# Altium schematic sheet MIPI_CSI-2.SchDoc
size A2
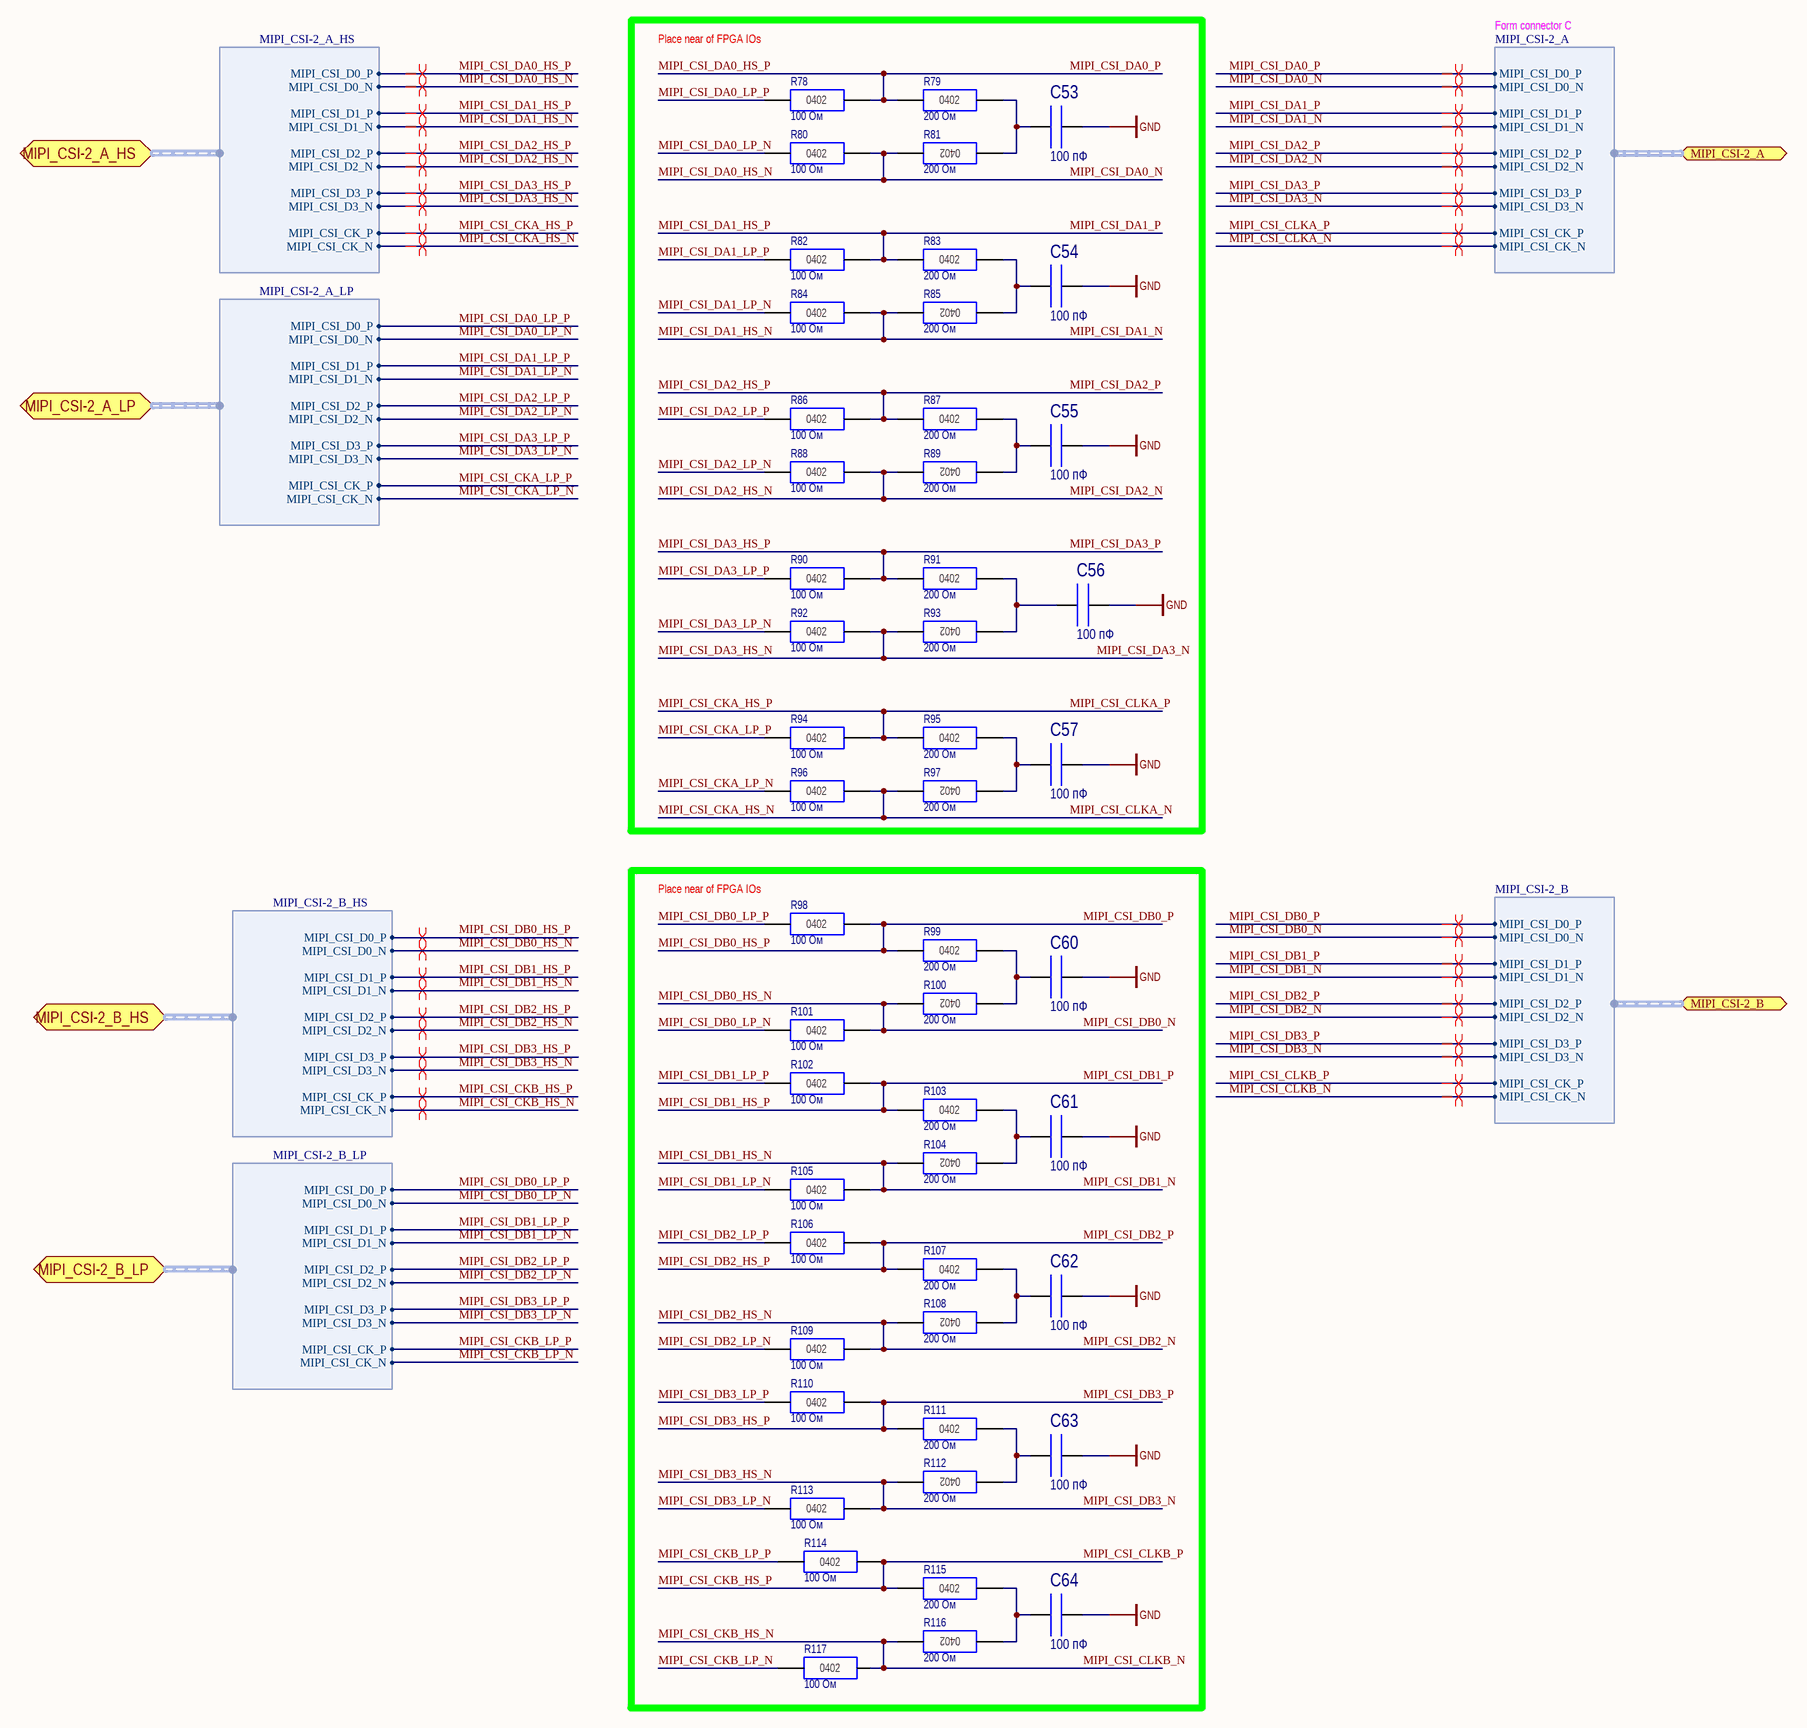
[diagram p0: MIPI_CSI-2.SchDoc]

## Parts
C53  value 100 пФ  [CC0402(1005)]  (hidden comment: CC0402-NP0-100 пФ-1%-50В)
C54  value 100 пФ  [CC0402(1005)]  (hidden comment: CC0402-NP0-100 пФ-1%-50В)
C55  value 100 пФ  [CC0402(1005)]  (hidden comment: CC0402-NP0-100 пФ-1%-50В)
C56  value 100 пФ  [CC0402(1005)]  (hidden comment: CC0402-NP0-100 пФ-1%-50В)
C57  value 100 пФ  [CC0402(1005)]  (hidden comment: CC0402-NP0-100 пФ-1%-50В)
C60  value 100 пФ  [CC0402(1005)]  (hidden comment: CC0402-NP0-100 пФ-1%-50В)
C61  value 100 пФ  [CC0402(1005)]  (hidden comment: CC0402-NP0-100 пФ-1%-50В)
C62  value 100 пФ  [CC0402(1005)]  (hidden comment: CC0402-NP0-100 пФ-1%-50В)
C63  value 100 пФ  [CC0402(1005)]  (hidden comment: CC0402-NP0-100 пФ-1%-50В)
C64  value 100 пФ  [CC0402(1005)]  (hidden comment: CC0402-NP0-100 пФ-1%-50В)
R78  value 100 Ом  [CR0402(1005)]  (hidden comment: CR0402-100 Ом-±5%)
R79  value 200 Ом  [CR0402(1005)]  (hidden comment: CR0402-200 Ом-±5%)
R80  value 100 Ом  [CR0402(1005)]  (hidden comment: CR0402-100 Ом-±5%)
R81  value 200 Ом  [CR0402(1005)]  (hidden comment: CR0402-200 Ом-±5%)
R82  value 100 Ом  [CR0402(1005)]  (hidden comment: CR0402-100 Ом-±5%)
R83  value 200 Ом  [CR0402(1005)]  (hidden comment: CR0402-200 Ом-±5%)
R84  value 100 Ом  [CR0402(1005)]  (hidden comment: CR0402-100 Ом-±5%)
R85  value 200 Ом  [CR0402(1005)]  (hidden comment: CR0402-200 Ом-±5%)
R86  value 100 Ом  [CR0402(1005)]  (hidden comment: CR0402-100 Ом-±5%)
R87  value 200 Ом  [CR0402(1005)]  (hidden comment: CR0402-200 Ом-±5%)
R88  value 100 Ом  [CR0402(1005)]  (hidden comment: CR0402-100 Ом-±5%)
R89  value 200 Ом  [CR0402(1005)]  (hidden comment: CR0402-200 Ом-±5%)
R90  value 100 Ом  [CR0402(1005)]  (hidden comment: CR0402-100 Ом-±5%)
R91  value 200 Ом  [CR0402(1005)]  (hidden comment: CR0402-200 Ом-±5%)
R92  value 100 Ом  [CR0402(1005)]  (hidden comment: CR0402-100 Ом-±5%)
R93  value 200 Ом  [CR0402(1005)]  (hidden comment: CR0402-200 Ом-±5%)
R94  value 100 Ом  [CR0402(1005)]  (hidden comment: CR0402-100 Ом-±5%)
R95  value 200 Ом  [CR0402(1005)]  (hidden comment: CR0402-200 Ом-±5%)
R96  value 100 Ом  [CR0402(1005)]  (hidden comment: CR0402-100 Ом-±5%)
R97  value 200 Ом  [CR0402(1005)]  (hidden comment: CR0402-200 Ом-±5%)
R98  value 100 Ом  [CR0402(1005)]  (hidden comment: CR0402-100 Ом-±5%)
R99  value 200 Ом  [CR0402(1005)]  (hidden comment: CR0402-200 Ом-±5%)
R100  value 200 Ом  [CR0402(1005)]  (hidden comment: CR0402-200 Ом-±5%)
R101  value 100 Ом  [CR0402(1005)]  (hidden comment: CR0402-100 Ом-±5%)
R102  value 100 Ом  [CR0402(1005)]  (hidden comment: CR0402-100 Ом-±5%)
R103  value 200 Ом  [CR0402(1005)]  (hidden comment: CR0402-200 Ом-±5%)
R104  value 200 Ом  [CR0402(1005)]  (hidden comment: CR0402-200 Ом-±5%)
R105  value 100 Ом  [CR0402(1005)]  (hidden comment: CR0402-100 Ом-±5%)
R106  value 100 Ом  [CR0402(1005)]  (hidden comment: CR0402-100 Ом-±5%)
R107  value 200 Ом  [CR0402(1005)]  (hidden comment: CR0402-200 Ом-±5%)
R108  value 200 Ом  [CR0402(1005)]  (hidden comment: CR0402-200 Ом-±5%)
R109  value 100 Ом  [CR0402(1005)]  (hidden comment: CR0402-100 Ом-±5%)
R110  value 100 Ом  [CR0402(1005)]  (hidden comment: CR0402-100 Ом-±5%)
R111  value 200 Ом  [CR0402(1005)]  (hidden comment: CR0402-200 Ом-±5%)
R112  value 200 Ом  [CR0402(1005)]  (hidden comment: CR0402-200 Ом-±5%)
R113  value 100 Ом  [CR0402(1005)]  (hidden comment: CR0402-100 Ом-±5%)
R114  value 100 Ом  [CR0402(1005)]  (hidden comment: CR0402-100 Ом-±5%)
R115  value 200 Ом  [CR0402(1005)]  (hidden comment: CR0402-200 Ом-±5%)
R116  value 200 Ом  [CR0402(1005)]  (hidden comment: CR0402-200 Ом-±5%)
R117  value 100 Ом  [CR0402(1005)]  (hidden comment: CR0402-100 Ом-±5%)

## Blocks framed on the sheet
Place near of FPGA IOs: C53-C57 R78-R97
Place near of FPGA IOs: C60-C64 R98-R117

## Ports
MIPI_CSI-2_A (harness MIPI_CSI-2_A), MIPI_CSI-2_A_HS (harness MIPI_CSI-2_A_HS), MIPI_CSI-2_A_LP (harness MIPI_CSI-2_A_LP), MIPI_CSI-2_B (harness MIPI_CSI-2_B), MIPI_CSI-2_B_HS (harness MIPI_CSI-2_B_HS), MIPI_CSI-2_B_LP (harness MIPI_CSI-2_B_LP)

## Harnesses
MIPI_CSI-2_A_HS: MIPI_CSI_D0_N, MIPI_CSI_D0_P, MIPI_CSI_D1_N, MIPI_CSI_D1_P, MIPI_CSI_D2_P, MIPI_CSI_D2_N, MIPI_CSI_D3_N, MIPI_CSI_D3_P, MIPI_CSI_CK_N, MIPI_CSI_CK_P
MIPI_CSI-2_A_LP: MIPI_CSI_D0_N, MIPI_CSI_D0_P, MIPI_CSI_D1_N, MIPI_CSI_D1_P, MIPI_CSI_D2_P, MIPI_CSI_D2_N, MIPI_CSI_D3_N, MIPI_CSI_D3_P, MIPI_CSI_CK_N, MIPI_CSI_CK_P
MIPI_CSI-2_B_HS: MIPI_CSI_D0_N, MIPI_CSI_D0_P, MIPI_CSI_D1_N, MIPI_CSI_D1_P, MIPI_CSI_D2_P, MIPI_CSI_D2_N, MIPI_CSI_D3_N, MIPI_CSI_D3_P, MIPI_CSI_CK_N, MIPI_CSI_CK_P
MIPI_CSI-2_B_LP: MIPI_CSI_D0_N, MIPI_CSI_D0_P, MIPI_CSI_D1_N, MIPI_CSI_D1_P, MIPI_CSI_D2_P, MIPI_CSI_D2_N, MIPI_CSI_D3_N, MIPI_CSI_D3_P, MIPI_CSI_CK_N, MIPI_CSI_CK_P
MIPI_CSI-2_A: MIPI_CSI_D0_N, MIPI_CSI_D0_P, MIPI_CSI_D1_N, MIPI_CSI_D1_P, MIPI_CSI_D2_P, MIPI_CSI_D2_N, MIPI_CSI_D3_N, MIPI_CSI_D3_P, MIPI_CSI_CK_N, MIPI_CSI_CK_P
MIPI_CSI-2_B: MIPI_CSI_D0_N, MIPI_CSI_D0_P, MIPI_CSI_D1_N, MIPI_CSI_D1_P, MIPI_CSI_D2_P, MIPI_CSI_D2_N, MIPI_CSI_D3_N, MIPI_CSI_D3_P, MIPI_CSI_CK_N, MIPI_CSI_CK_P

## Nets
GND: C53.1(+) C54.1(+) C55.1(+) C56.1(+) C57.1(+) C60.1(+) C61.1(+) C62.1(+) C63.1(+) C64.1(+)
MIPI_CSI_CKA_HS_N: R96.2(-) R97.2(-) ; port MIPI_CSI-2_A_HS.MIPI_CSI_CK_N, port MIPI_CSI-2_A.MIPI_CSI_CK_N  [also labelled MIPI_CSI_CLKA_N]
MIPI_CSI_CKA_HS_P: R94.2(-) R95.1(+) ; port MIPI_CSI-2_A_HS.MIPI_CSI_CK_P, port MIPI_CSI-2_A.MIPI_CSI_CK_P  [also labelled MIPI_CSI_CLKA_P]
MIPI_CSI_CKA_LP_N: R96.1(+) ; port MIPI_CSI-2_A_LP.MIPI_CSI_CK_N
MIPI_CSI_CKA_LP_P: R94.1(+) ; port MIPI_CSI-2_A_LP.MIPI_CSI_CK_P
MIPI_CSI_CKB_HS_N: R116.2(-) R117.2(-) ; port MIPI_CSI-2_B_HS.MIPI_CSI_CK_N, port MIPI_CSI-2_B.MIPI_CSI_CK_N  [also labelled MIPI_CSI_CLKB_N]
MIPI_CSI_CKB_HS_P: R114.2(-) R115.1(+) ; port MIPI_CSI-2_B_HS.MIPI_CSI_CK_P, port MIPI_CSI-2_B.MIPI_CSI_CK_P  [also labelled MIPI_CSI_CLKB_P]
MIPI_CSI_CKB_LP_N: R117.1(+) ; port MIPI_CSI-2_B_LP.MIPI_CSI_CK_N
MIPI_CSI_CKB_LP_P: R114.1(+) ; port MIPI_CSI-2_B_LP.MIPI_CSI_CK_P
MIPI_CSI_DA0_HS_N: R80.2(-) R81.2(-) ; port MIPI_CSI-2_A_HS.MIPI_CSI_D0_N, port MIPI_CSI-2_A.MIPI_CSI_D0_N  [also labelled MIPI_CSI_DA0_N]
MIPI_CSI_DA0_HS_P: R78.2(-) R79.1(+) ; port MIPI_CSI-2_A_HS.MIPI_CSI_D0_P, port MIPI_CSI-2_A.MIPI_CSI_D0_P  [also labelled MIPI_CSI_DA0_P]
MIPI_CSI_DA0_LP_N: R80.1(+) ; port MIPI_CSI-2_A_LP.MIPI_CSI_D0_N
MIPI_CSI_DA0_LP_P: R78.1(+) ; port MIPI_CSI-2_A_LP.MIPI_CSI_D0_P
MIPI_CSI_DA1_HS_N: R84.2(-) R85.2(-) ; port MIPI_CSI-2_A_HS.MIPI_CSI_D1_N, port MIPI_CSI-2_A.MIPI_CSI_D1_N  [also labelled MIPI_CSI_DA1_N]
MIPI_CSI_DA1_HS_P: R82.2(-) R83.1(+) ; port MIPI_CSI-2_A_HS.MIPI_CSI_D1_P, port MIPI_CSI-2_A.MIPI_CSI_D1_P  [also labelled MIPI_CSI_DA1_P]
MIPI_CSI_DA1_LP_N: R84.1(+) ; port MIPI_CSI-2_A_LP.MIPI_CSI_D1_N
MIPI_CSI_DA1_LP_P: R82.1(+) ; port MIPI_CSI-2_A_LP.MIPI_CSI_D1_P
MIPI_CSI_DA2_HS_N: R88.2(-) R89.2(-) ; port MIPI_CSI-2_A_HS.MIPI_CSI_D2_N, port MIPI_CSI-2_A.MIPI_CSI_D2_N  [also labelled MIPI_CSI_DA2_N]
MIPI_CSI_DA2_HS_P: R86.2(-) R87.1(+) ; port MIPI_CSI-2_A_HS.MIPI_CSI_D2_P, port MIPI_CSI-2_A.MIPI_CSI_D2_P  [also labelled MIPI_CSI_DA2_P]
MIPI_CSI_DA2_LP_N: R88.1(+) ; port MIPI_CSI-2_A_LP.MIPI_CSI_D2_N
MIPI_CSI_DA2_LP_P: R86.1(+) ; port MIPI_CSI-2_A_LP.MIPI_CSI_D2_P
MIPI_CSI_DA3_HS_N: R92.2(-) R93.2(-) ; port MIPI_CSI-2_A_HS.MIPI_CSI_D3_N, port MIPI_CSI-2_A.MIPI_CSI_D3_N  [also labelled MIPI_CSI_DA3_N]
MIPI_CSI_DA3_HS_P: R90.2(-) R91.1(+) ; port MIPI_CSI-2_A_HS.MIPI_CSI_D3_P, port MIPI_CSI-2_A.MIPI_CSI_D3_P  [also labelled MIPI_CSI_DA3_P]
MIPI_CSI_DA3_LP_N: R92.1(+) ; port MIPI_CSI-2_A_LP.MIPI_CSI_D3_N
MIPI_CSI_DA3_LP_P: R90.1(+) ; port MIPI_CSI-2_A_LP.MIPI_CSI_D3_P
MIPI_CSI_DB0_HS_N: R100.2(-) R101.2(-) ; port MIPI_CSI-2_B_HS.MIPI_CSI_D0_N, port MIPI_CSI-2_B.MIPI_CSI_D0_N  [also labelled MIPI_CSI_DB0_N]
MIPI_CSI_DB0_HS_P: R98.2(-) R99.1(+) ; port MIPI_CSI-2_B_HS.MIPI_CSI_D0_P, port MIPI_CSI-2_B.MIPI_CSI_D0_P  [also labelled MIPI_CSI_DB0_P]
MIPI_CSI_DB0_LP_N: R101.1(+) ; port MIPI_CSI-2_B_LP.MIPI_CSI_D0_N
MIPI_CSI_DB0_LP_P: R98.1(+) ; port MIPI_CSI-2_B_LP.MIPI_CSI_D0_P
MIPI_CSI_DB1_HS_N: R104.2(-) R105.2(-) ; port MIPI_CSI-2_B_HS.MIPI_CSI_D1_N, port MIPI_CSI-2_B.MIPI_CSI_D1_N  [also labelled MIPI_CSI_DB1_N]
MIPI_CSI_DB1_HS_P: R102.2(-) R103.1(+) ; port MIPI_CSI-2_B_HS.MIPI_CSI_D1_P, port MIPI_CSI-2_B.MIPI_CSI_D1_P  [also labelled MIPI_CSI_DB1_P]
MIPI_CSI_DB1_LP_N: R105.1(+) ; port MIPI_CSI-2_B_LP.MIPI_CSI_D1_N
MIPI_CSI_DB1_LP_P: R102.1(+) ; port MIPI_CSI-2_B_LP.MIPI_CSI_D1_P
MIPI_CSI_DB2_HS_N: R108.2(-) R109.2(-) ; port MIPI_CSI-2_B_HS.MIPI_CSI_D2_N, port MIPI_CSI-2_B.MIPI_CSI_D2_N  [also labelled MIPI_CSI_DB2_N]
MIPI_CSI_DB2_HS_P: R106.2(-) R107.1(+) ; port MIPI_CSI-2_B_HS.MIPI_CSI_D2_P, port MIPI_CSI-2_B.MIPI_CSI_D2_P  [also labelled MIPI_CSI_DB2_P]
MIPI_CSI_DB2_LP_N: R109.1(+) ; port MIPI_CSI-2_B_LP.MIPI_CSI_D2_N
MIPI_CSI_DB2_LP_P: R106.1(+) ; port MIPI_CSI-2_B_LP.MIPI_CSI_D2_P
MIPI_CSI_DB3_HS_N: R112.2(-) R113.2(-) ; port MIPI_CSI-2_B_HS.MIPI_CSI_D3_N, port MIPI_CSI-2_B.MIPI_CSI_D3_N  [also labelled MIPI_CSI_DB3_N]
MIPI_CSI_DB3_HS_P: R110.2(-) R111.1(+) ; port MIPI_CSI-2_B_HS.MIPI_CSI_D3_P, port MIPI_CSI-2_B.MIPI_CSI_D3_P  [also labelled MIPI_CSI_DB3_P]
MIPI_CSI_DB3_LP_N: R113.1(+) ; port MIPI_CSI-2_B_LP.MIPI_CSI_D3_N
MIPI_CSI_DB3_LP_P: R110.1(+) ; port MIPI_CSI-2_B_LP.MIPI_CSI_D3_P
NetC53_2: C53.2(-) R79.2(-) R81.1(+)
NetC54_2: C54.2(-) R83.2(-) R85.1(+)
NetC55_2: C55.2(-) R87.2(-) R89.1(+)
NetC56_2: C56.2(-) R91.2(-) R93.1(+)
NetC57_2: C57.2(-) R95.2(-) R97.1(+)
NetC60_2: C60.2(-) R99.2(-) R100.1(+)
NetC61_2: C61.2(-) R103.2(-) R104.1(+)
NetC62_2: C62.2(-) R107.2(-) R108.1(+)
NetC63_2: C63.2(-) R111.2(-) R112.1(+)
NetC64_2: C64.2(-) R115.2(-) R116.1(+)

## Layout directives
differential pair: MIPI_CSI_CKA_HS_N, MIPI_CSI_CKA_HS_P, MIPI_CSI_CKB_HS_N, MIPI_CSI_CKB_HS_P, MIPI_CSI_DA0_HS_N, MIPI_CSI_DA0_HS_P, MIPI_CSI_DA1_HS_N, MIPI_CSI_DA1_HS_P, MIPI_CSI_DA2_HS_N, MIPI_CSI_DA2_HS_P, MIPI_CSI_DA3_HS_N, MIPI_CSI_DA3_HS_P, MIPI_CSI_DB0_HS_N, MIPI_CSI_DB0_HS_P, MIPI_CSI_DB1_HS_N, MIPI_CSI_DB1_HS_P, MIPI_CSI_DB2_HS_N, MIPI_CSI_DB2_HS_P, MIPI_CSI_DB3_HS_N, MIPI_CSI_DB3_HS_P

## Notes on the sheet
- Form connector C
- (in symbol CR0402-#-±5%) 0402

## Library data of the parts
C53-C57 C60-C64 = CC0402-X7R-#-20%-10В: Чип конденсатор керамический; Supplier 1: Digi-Key; Supplier Part Number 1: 490-8180-2-ND
R78-R117 = CR0402-#-±5%: Чип резистор; Maximum Working Voltage: 50 В; TOLERANCE: 5%; Supplier 1: Digi-Key
  R78 R80 R82 R84 R86 R88 R90 R92 R94 R96 R98 R101 R102 R105 R106 R109 R110 R113 R114 R117: Supplier Part Number 1: 311-100JRTR-ND
  R79 R81 R83 R85 R87 R89 R91 R93 R95 R97 R99 R100 R103 R104 R107 R108 R111 R112 R115 R116: Supplier Part Number 1: 311-200JRTR-ND